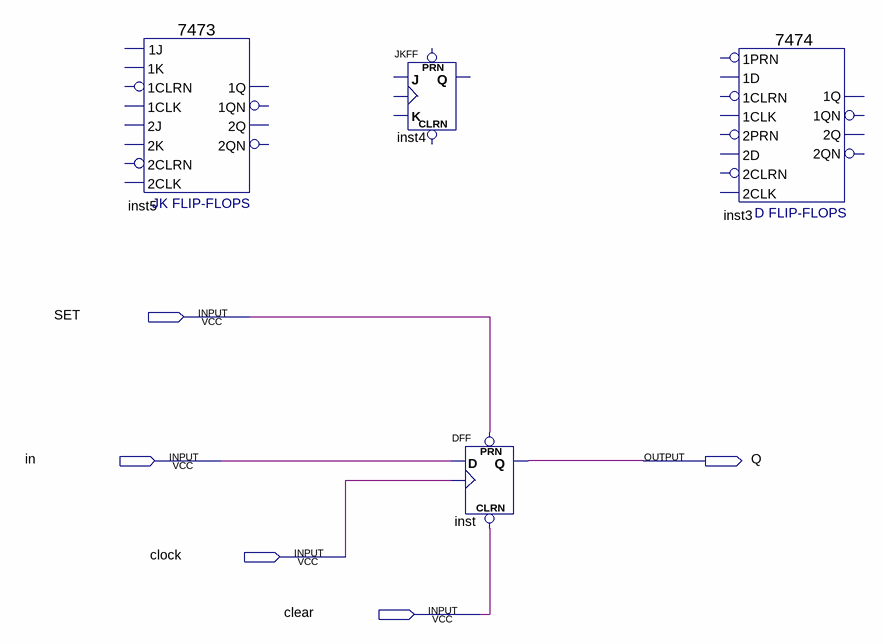
[diagram p0: schematic sheet]
// Quartus schematic DffValidation.bdf as structural Verilog: 4 symbols, 5 pins
module DffValidation (
  input  SET,
  input  in,
  input  clock,
  input  clear,
  output Q
);

  \7473  inst5 ();  // open: 1J, 1CLRN, 1K, 1CLK, 2J, 2CLK, 2CLRN, 2K, 1QN, 2Q, 2QN, 1Q
  JKFF inst4 ();  // open: PRN, CLRN, K, J, CLK, Q
  DFF inst (.CLRN(clear), .CLK(clock), .D(in), .PRN(SET), .Q(Q));
  \7474  inst3 ();  // open: 2D, 2PRN, 1CLK, 1D, 1PRN, 2CLK, 2CLRN, 1CLRN, 1QN, 2Q, 2QN, 1Q
endmodule
